# EasyEDA Pro project ProPrj_New Project_2026-04-18_10-00-05_2026-04-18 (3).epro

# Schematic Schematic1
Board Name: Board1; Create Date: 2026-04-18; Page Name: P1; Project Name: New Project_2026-04-18_10-00-05; Schematic Name: Schematic1; Update Date: 2026-04-18; Company: EasyEDA.com; Page Size: A4; Version: V1.0
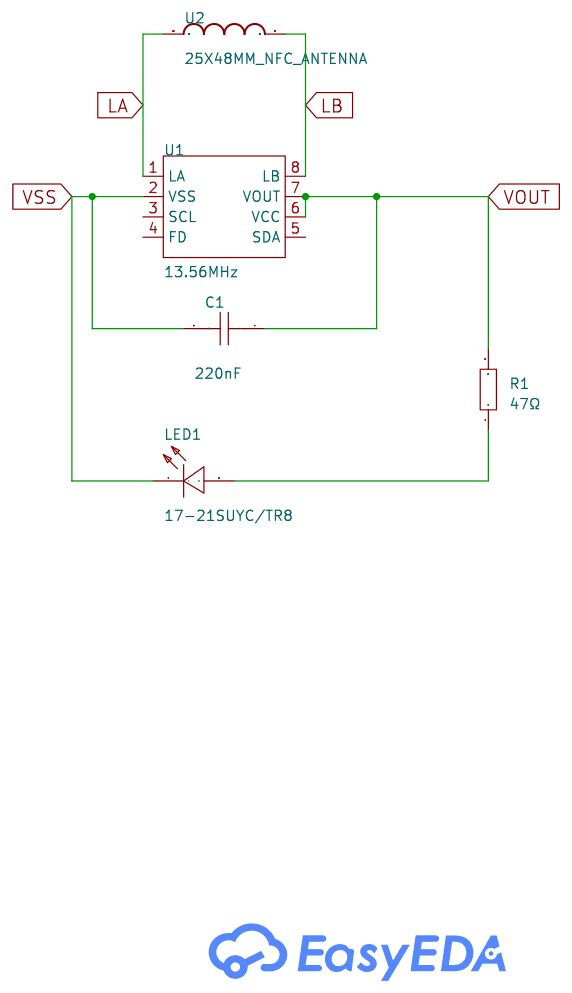
[diagram p0: schematic sheet]

## Parts
C1  220nF  [C0603]
LED1  17-21SUYC/TR8  [LED0805-RD]
R1  47Ω  [R0603]
U1  13.56MHz  [XQFN-8_L1.6-W1.6-P0.50-BL_NT3H2111W0FHKH]
U2  25X48MM_NFC_ANTENNA  [25X48MM_NFC_ANTENNA]

## Library data of the parts
C1 = CAP_0603: Supplier Footprint: 0603
LED1 = 17-21SUYC/TR8: link: https://item.szlcsc.com/255094.html; Supplier: LCSC; Manufacturer: KENTO; Supplier Part: C2296; JLCPCB Part Class: Basic Part
R1 = Res_0603: Supplier Footprint: 0603
U1 = NT3H2111W0FHKH: agreement:ISO 14443 interface type:I2C Frequency:13.56MHz Frequency:13.56MHz mains input:3.3V mains input:3.3V; Supplier Part: C710403; Manufacturer: NXP(恩智浦); Supplier Footprint: XQFN-8(1.6x1.6); JLCPCB Part Class: Extended Part; Datasheet: https://www.nxp.com/docs/en/data-sheet/NT3H2111_2211.pdf; Supplier: LCSC; agreement: ISO 14443; interface type: I2C; mains input: 3.3V
U2 = 25X48MM_NFC_ANTENNA

## Nets
VSS: C1.2 LED1.1(-) U1.2(VSS)
LA: U1.1(LA) U2.P$1
LB: U1.8(LB) U2.P$2
VOUT: C1.1 R1.2 U1.6(VCC) U1.7(VOUT)
$1N486: LED1.2(+) R1.1

Not connected (* = marked no-connect by the designer): U1 3(SCL) 4(FD) 5(SDA)

# Board PCB1
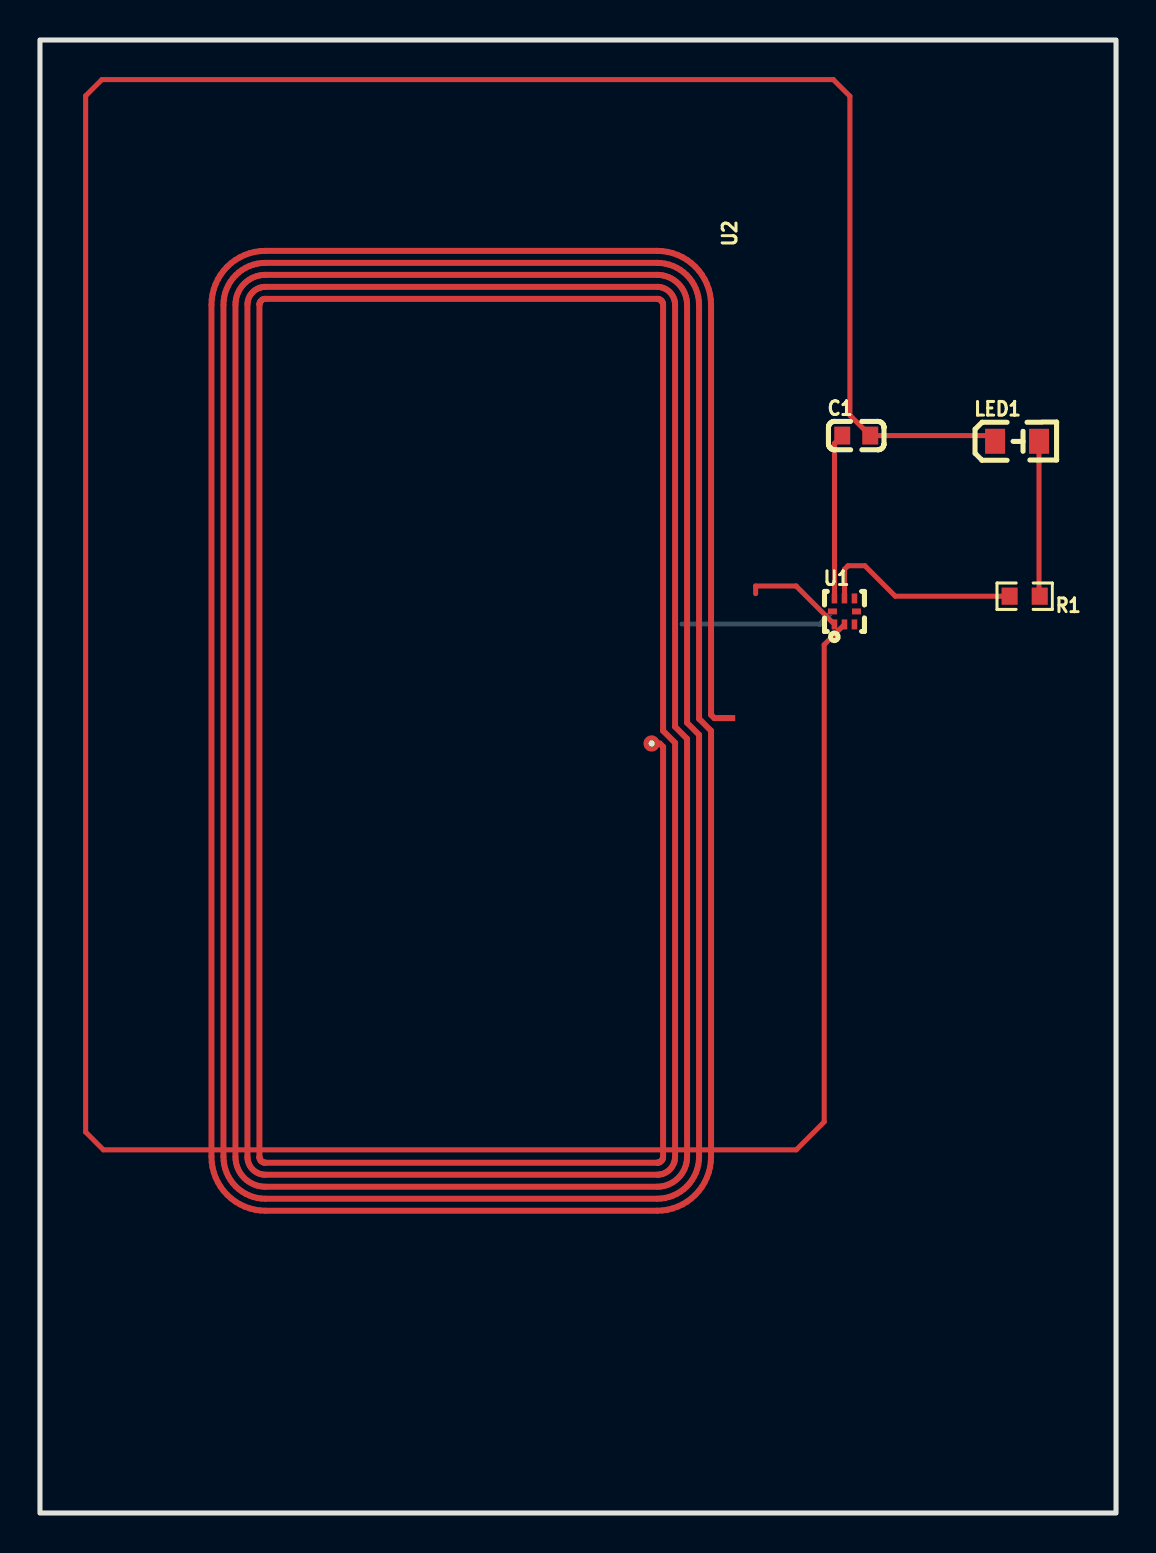
[diagram p1: board, top side]
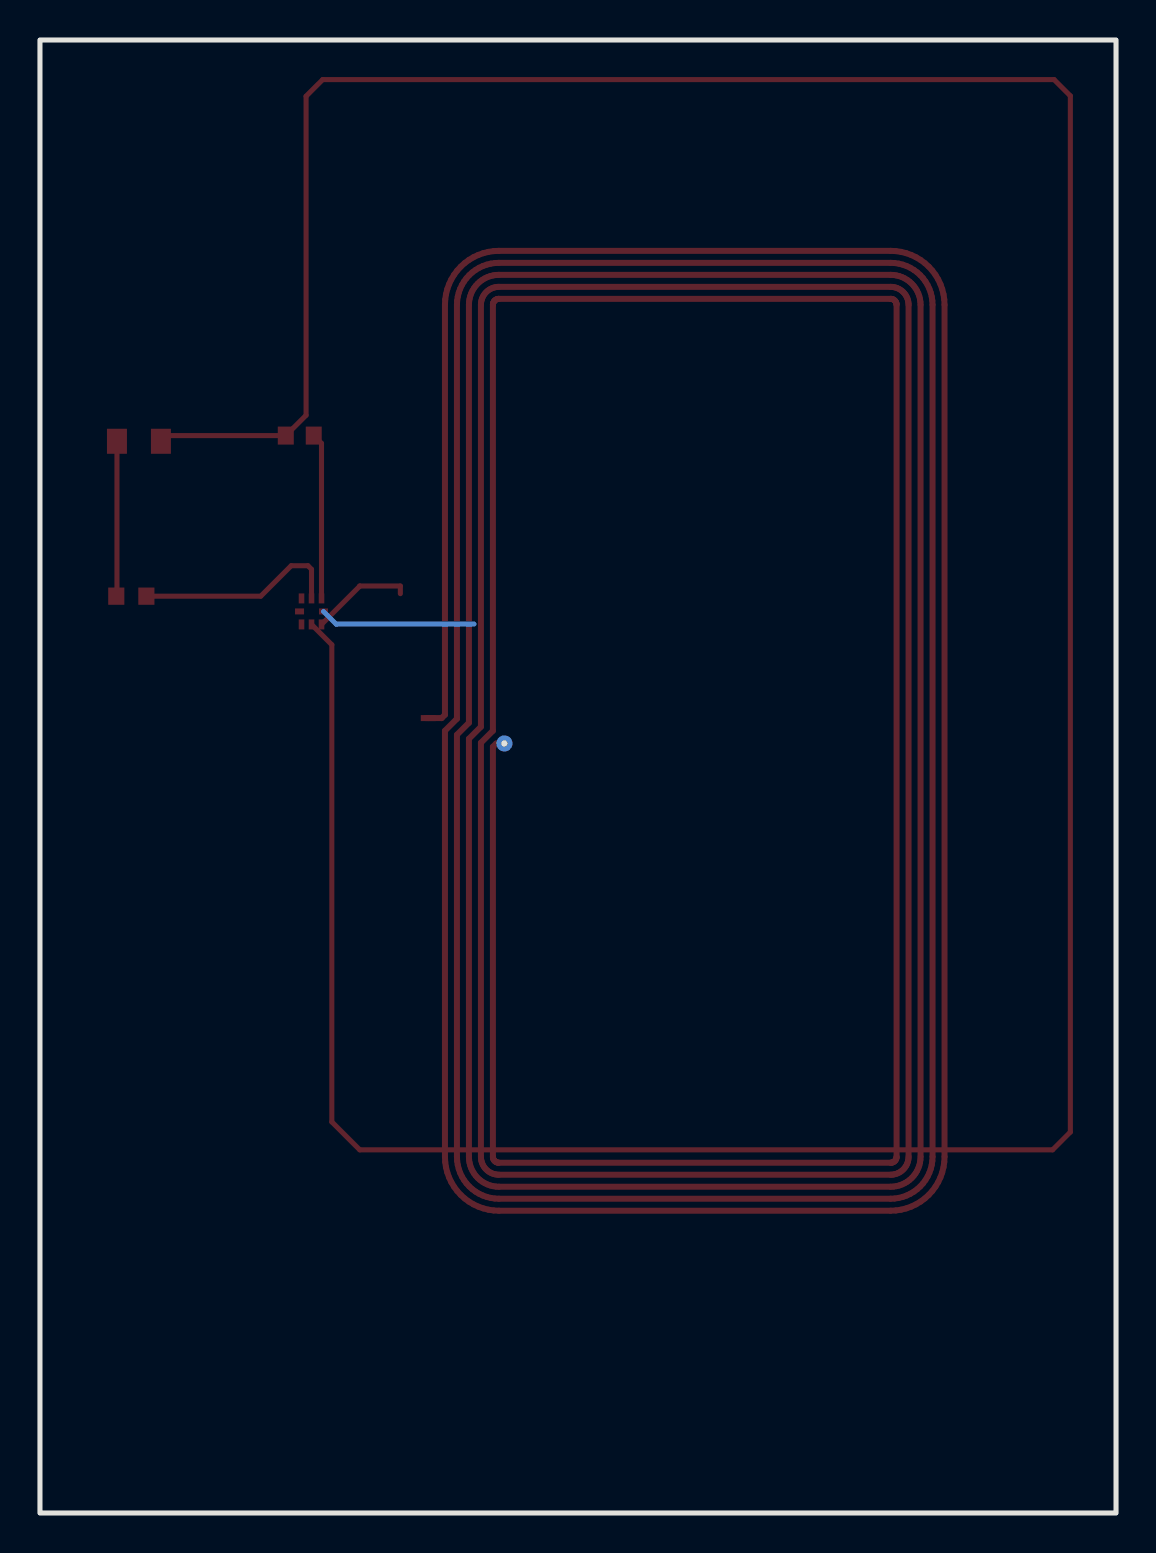
[diagram p2: board, bottom side, seen from below]

Outline 53.85 x 73.66 mm; copper layers: Top Layer, Bottom Layer. Coordinates in mm from the lower left corner of the outline.
Outline path: rectangle 0,73.66 53.85,0
Stack: Top Layer 0.035mm / Dielectric1 1.51mm FR4 er 4.5 / Bottom Layer 0.035mm

## Design rules (mm)
template: Custom Config
spacing copperThickness1oz (default): track to track 0, other pairs 0 to 0.3
spacing copperThickness2oz: track to track 0.203, other pairs 0.152 to 0.3
track width copperThickness1oz (default): min 0.127, default 0.254, max 2.54
track width copperThickness2oz: min 0.203, default 0.254, max 2.54
differential pair differentialPair (default): width min 0.127, default 0.254, max 2.54; gap min 0.152, default 0.152
via viaSize (default): diameter min 0.5, default 0.61, max 10; hole min 0.3, default 0.305, max 6.3

## Placement (name value [footprint] x y rotation side)
C1  220nF  [C0603]  40.85 53.88 0 top
LED1  17-21SUYC/TR8  [LED0805-RD]  48.89 53.59 0 top
R1  47Ω  [R0603]  49.28 45.85 180 top
U1  13.56MHz  [XQFN-8_L1.6-W1.6-P0.50-BL_NT3H2111W0FHKH]  40.26 45.08 0 top
U2  -  [25X48MM_NFC_ANTENNA]  21.08 39.12 270 top

## Footprints (pads in the part's own frame, mm; a bottom-side part is the same pattern mirrored in y, then rotated)
25X48MM_NFC_ANTENNA
  rect 0.3x0.75 smd: P$1(-0.635,13.335)
  round 0.808 hole 0.3: P$2(0.635,9.525)
C0603
  rect 0.8x0.9 smd: 1(-0.7,0) 2(0.7,0)
LED0805-RD
  rect 1x1.25 smd: 1(-1.1,0) 2(1.1,0)
R0603
  rect 0.806x0.864 smd: 1(-0.753,0) 2(0.753,0)
XQFN-8_L1.6-W1.6-P0.50-BL_NT3H2111W0FHKH
  rect 0.28x0.5 smd: 1(-0.5,-0.65) 2(0,-0.65) 3(0.5,-0.65) 5(0.5,0.65) 6(0,0.65) 7(-0.5,0.65)
  rect 0.45x0.3 smd: 4(0.6,0) 8(-0.6,0)

## Nets
As in the schematic.

Pads without a net: U1 3 4 5

## Routing (per net, layer and track width the routed paths; a pad name or vN(x,y) marks a point on that pad's centre or on a via; arc(x,y) is an arc through that point)
VSS: length 177.7
  Top Layer w0.254: LED1.1 47.51,53.88 C1.2 40.53,54.89 40.53,70.85 39.7,71.68 3.1,71.68 2.29,70.87 2.29,19.05 3.17,18.16 37.85,18.16 39.24,19.56 39.24,43.42 U1.2
LA: length 5.1
  Top Layer w0.254: U1.1 37.85,46.35 37.85,46.36 35.81,46.36 35.81,45.97
LB: length 7.8
  Bottom Layer w0.254: 32.13,44.45 39.02,44.45 U1.8
VOUT: length 18.2
  Top Layer w0.254: R1.2 42.8,45.85 41.27,47.37 40.44,47.37 40.26,47.19 40.26,45.99 ; 39.76,45.99 39.76,53.49 C1.1
$1N486: length 7.8
  Top Layer w0.254: R1.1 49.99,45.88 LED1.2
